# EAGLE schematic 5V-to-12V-Converter-alt2 (EAGLE 7.6.0)
+5V to +13V Converter A cheap circuit to make +13V from a +5V supply Roman Black - orig Sep 2002 - updated Aug 2006 http://www.romanblack.com/smps/conv.htm
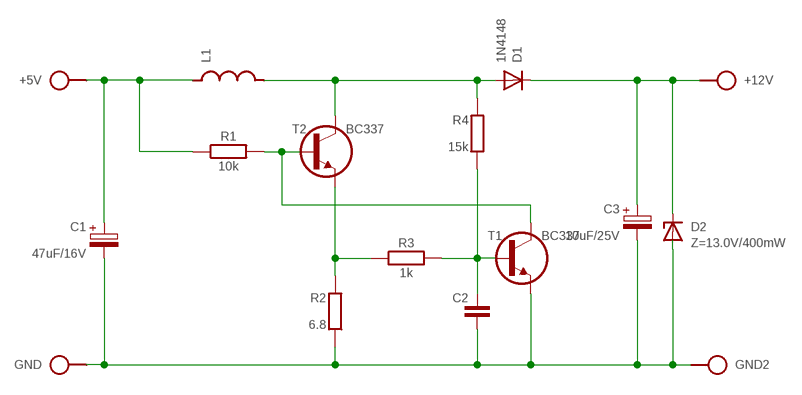
[diagram p0: schematic, sheet 1]

## Parts
+5V  SPAD  [SPAD]
+12V  SPAD  [SPAD]
C1  47uF/16V  CPOLE2,5-4/V  [E2.5-4/V]
C2  C050-025X075  [C050-025X075]
C3  10uF/25V  CPOLE2,5-4/V  [E2.5-4/V]
D1  1N4148  1N414834-7  [DO34-7]
D2  Z=13.0V/400mW  Z-DIODE34Z10V  [DO34Z10V]
GND  SPAD  [SPAD]
GND2  SPAD  [SPAD]
L1  L-SHORT02/5  [L-02/5V]
R1  10k  R-H0204/10  [0204/10]
R2  6.8  R0204/10  [0204/10]
R3  1k  R-H0204/10  [0204/10]
R4  15k  R0204/10  [0204/10]
T1  BC337  BC337CBE  [TO92-CBE]
T2  BC337  BC337CBE  [TO92-CBE]

## Nets
N$1: R1.2 T1.C T2.B
N$2: +5V.1 C1.+ L1.2 R1.1
N$3: +12V.1 C3.+ D1.C D2.C
N$4: C1.- C2.2 C3.- D2.A GND2.1 GND.1 R2.1 T1.E
N$5: R2.2 R3.1 T2.E
N$6: C2.1 R3.2 R4.1 T1.B
N$8: D1.A L1.1 R4.2 T2.C

## Library data of the parts
+5V +12V GND GND2 = pad:SPAD
C1 C3 = c:CPOL: POLARIZED CAPACITOR, European symbol
C2 = c:C: CAPACITOR, European symbol
D1 = d:1N4148
D2 = d:Z-DIODE
L1 = l:L-SHORT
R1 R3 = r:R-H
R2 R4 = r:R: RESISTOR, European symbol
T1 T2 = t:BC337